# EAGLE design ZeroESPminimal (EAGLE 6.5.0)
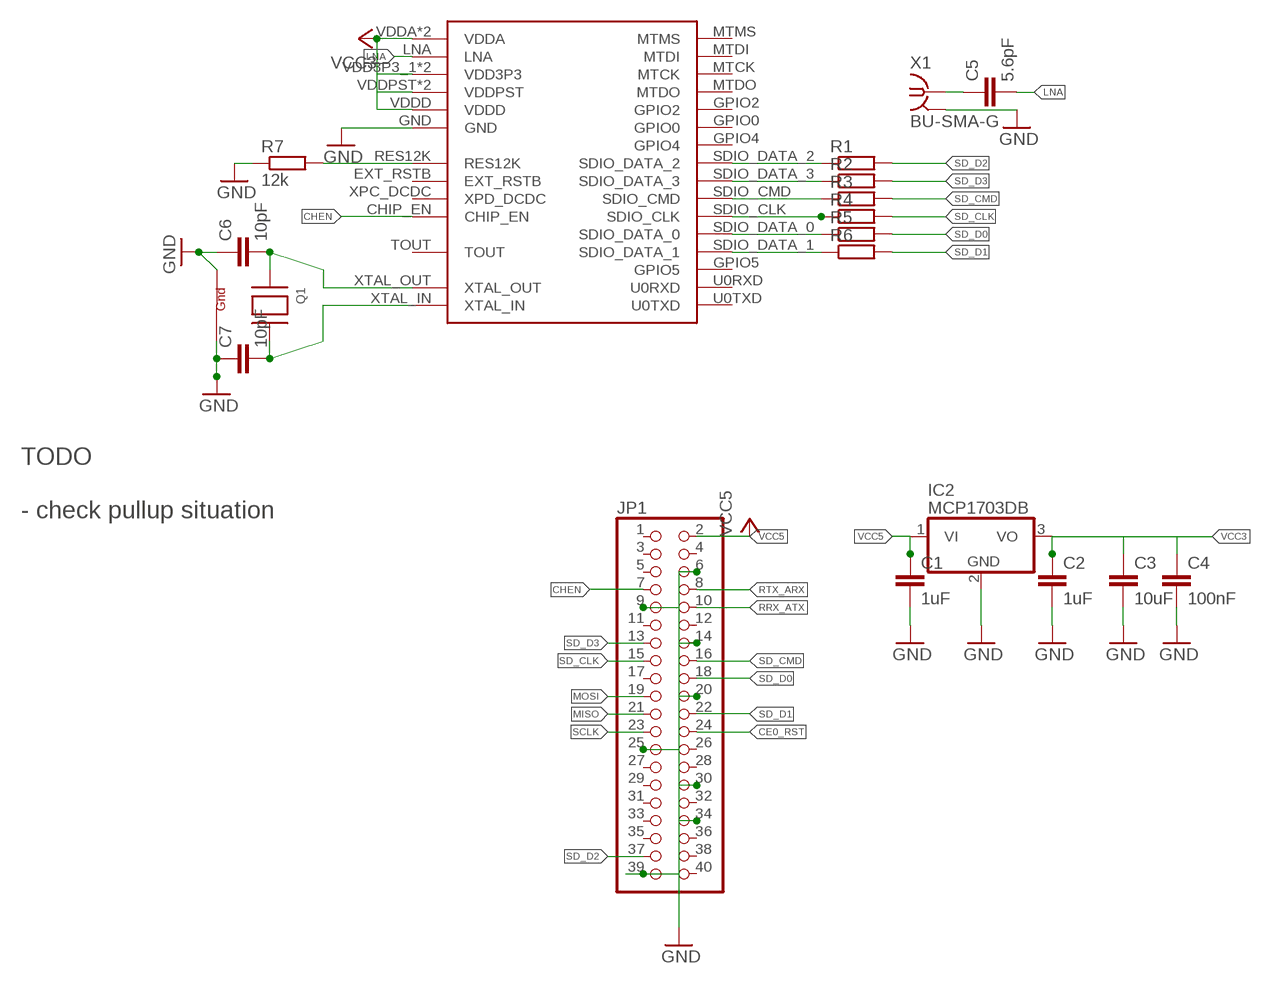
[diagram p0: schematic, sheet 1]

## Parts
C1  1uF  C-EUC1206  [C1206]
C2  1uF  C-EUC1206  [C1206]
C3  10uF  C-EUC1206  [C1206]
C4  100nF  C-EUC1206  [C1206]
C5  5.6pF  C-EUC0402  [C0402]
C6  10pF  C-EUC0402  [C0402]
C7  10pF  C-EUC0402  [C0402]
IC2  MCP1703DB  [SOT223]
JP1  PINHD-2X20  [2X20]
Q1  XTAL-4-3225  [NX3225]
R1  R-EU_R0402  [R0402]
R2  R-EU_R0402  [R0402]
R3  R-EU_R0402  [R0402]
R4  R-EU_R0402  [R0402]
R5  R-EU_R0402  [R0402]
R6  R-EU_R0402  [R0402]
R7  12k  R-EU_R0402  [R0402]
U$3  ESP8266EX  [ESP8266EX]
X1  BU-SMA-G  [BU-SMA-G]

## Nets
$N22: R3.1 U$3.SDIO_CMD
$N23: R5.1 U$3.SDIO_DATA_0
$N24: R6.1 U$3.SDIO_DATA_1
CE0_RST: JP1.24
CHEN: JP1.7 U$3.CHIP_EN
GND: C1.2 C2.2 C3.2 C4.2 C6.1 C7.1 IC2.2(GND) JP1.6 JP1.9 JP1.14 JP1.20 JP1.25 JP1.30 JP1.34 JP1.39 Q1.2(G2) Q1.4(G1) R7.1 U$3.GND X1.2 X1.3 X1.4 X1.5
LNA: C5.2 U$3.LNA
MISO: JP1.21
MOSI: JP1.19
N$1: R1.1 U$3.SDIO_DATA_2
N$2: R2.1 U$3.SDIO_DATA_3
N$3: C5.1 X1.1
N$4: R4.1 U$3.SDIO_CLK
N$5: R7.2 U$3.RES12K
N$7: C6.2 Q1.1(X1) U$3.XTAL_OUT
N$9: C7.2 Q1.3(X2) U$3.XTAL_IN
RRX_ATX: JP1.10
RTX_ARX: JP1.8
SCLK: JP1.23
SD_CLK: JP1.15 R4.2
SD_CMD: JP1.16 R3.2
SD_D0: JP1.18 R5.2
SD_D1: JP1.22 R6.2
SD_D2: JP1.37 R1.2
SD_D3: JP1.13 R2.2
VCC3: C2.1 C3.1 C4.1 IC2.3(VO) U$3.VDD3P3_1(VDD3P3) U$3.VDD3P3_2(VDD3P3) U$3.VDDA U$3.VDDA_2(VDDA) U$3.VDDD U$3.VDDPST U$3.VDDPST_2(VDDPST)
VCC5: C1.1 IC2.1(VI) JP1.2
Unconnected: JP1.1 JP1.3 JP1.4 JP1.5 JP1.11 JP1.12 JP1.17 JP1.26 JP1.27 JP1.28 JP1.29 JP1.31 JP1.32 JP1.33 JP1.35 JP1.36 JP1.38 JP1.40 U$3.EXT_RSTB U$3.GPIO0 U$3.GPIO2 U$3.GPIO4 U$3.GPIO5 U$3.MTCK U$3.MTDI U$3.MTDO U$3.MTMS U$3.TOUT U$3.U0RXD U$3.U0TXD U$3.XPC_DCDC(XPD_DCDC)

## Notes on the sheet
- TODO
  
  - check pullup situation

## Library data of the parts
C1-C4 = rcl:C-EU: CAPACITOR, European symbol
C5-C7 = resistor:C-EU: CAPACITOR, European symbol
IC2 = linear:MCP1703: 250 mA, 16V, Low Quiescent Current LDO Regulator Source: http://ww1.microchip.com/downloads/en/DeviceDoc/22049b.pdf
JP1 = adafruit:PINHD-2X20: PIN HEADER
Q1 = adafruit:XTAL-4: Classic 4-pin 3.2 x 2.5mm crystal
R1-R6 = rcl:R-EU_: RESISTOR, European symbol
R7 = resistor:R-EU_: RESISTOR, European symbol
U$3 = ESP8266EX:ESP8266EX
X1 = con-coax:BU-SMA-G: FEMALE SMA CONNECTOR Radiall distributor RS 193-9117; OC_FARNELL: unknown; OC_NEWARK: unknown

## Board
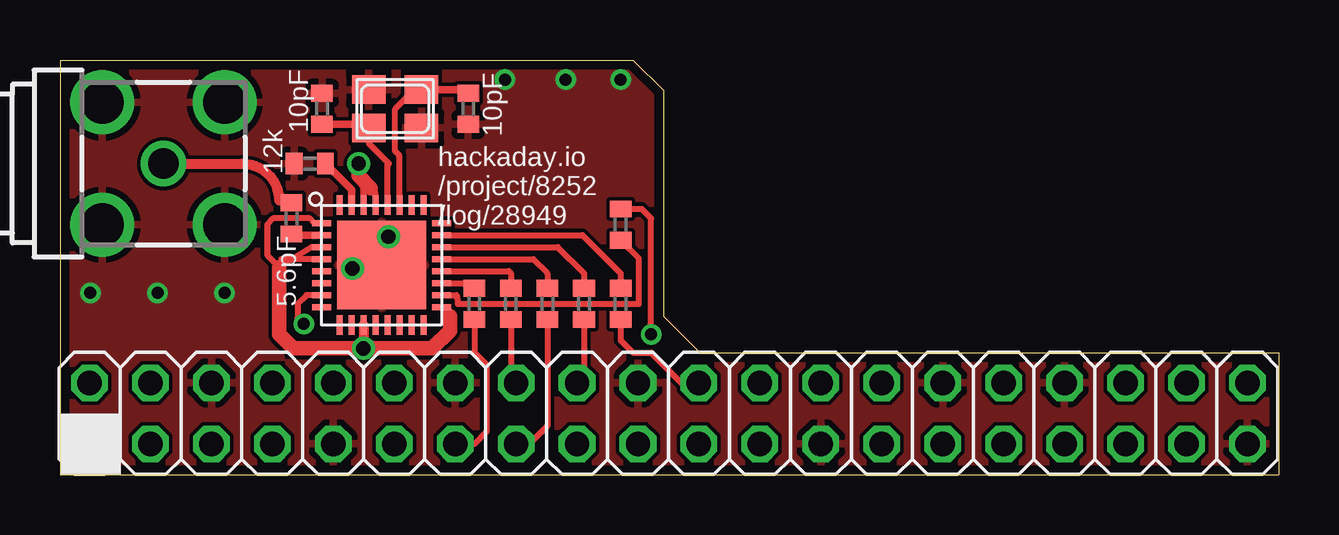
[diagram p1: board, top side]
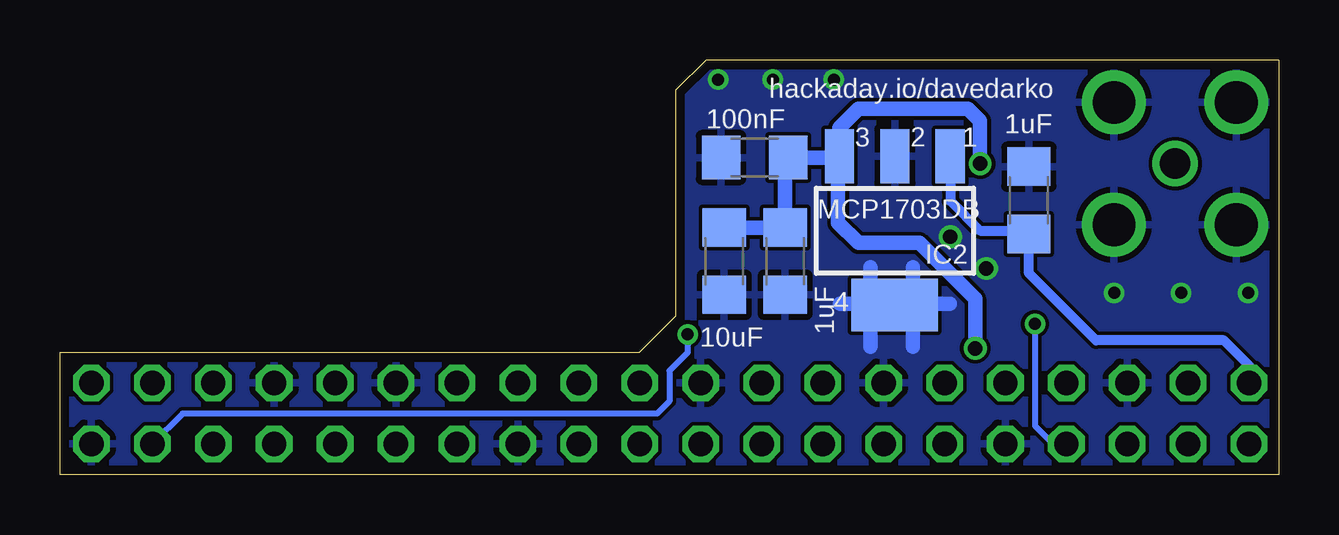
[diagram p2: board, bottom side, seen from below]

Size 50.8 x 17.27 mm. Coordinates in mm from the lower left corner, seen from the top.
Outline: 0,0 50.8,0 50.8,5.08 26.67,5.08 25.15,6.6 25.15,16 23.88,17.27 0,17.27 0,0
Copper layers (1*16): Top 0.0356mm / dielectric 1.5011mm / Bottom 0.0356mm
Design rules "LaenPCBOrder *": minimum track width 6mil, minimum drill 13mil, track to track 6mil, track to pad 6mil, pad to pad 6mil, via to via 6mil, smd to smd 6mil, copper to edge 15mil, drill to drill 6mil, minimum pad ring 7mil, minimum via ring 7mil, stop-mask expansion 3mil, vias tented up to drill 200mil, thermal gap 10mil

### Footprints (pad centres in the part's own frame; a part is rotated, then mirrored left to right if it is on the bottom)
C1206 = smd 1.6 x 1.8: 1 -1.4,0; 2 1.4,0
C0402 = smd 0.7 x 0.9: 1 -0.65,0; 2 0.65,0
SOT223 = smd 1.219 x 2.235: 1 -2.311,-3.099; 2 0,-3.099; 3 2.311,-3.099 | smd 3.6 x 2.2: 4 0,3.099
2X20 = drill 1.016 octagon: 1 -24.13,-1.27; 2 -24.13,1.27; 3 -21.59,-1.27; 4 -21.59,1.27; 5 -19.05,-1.27; 6 -19.05,1.27; 7 -16.51,-1.27; 8 -16.51,1.27; 9 -13.97,-1.27; 10 -13.97,1.27; 11 -11.43,-1.27; 12 -11.43,1.27; 13 -8.89,-1.27; 14 -8.89,1.27; 15 -6.35,-1.27; 16 -6.35,1.27; 17 -3.81,-1.27; 18 -3.81,1.27; 19 -1.27,-1.27; 20 -1.27,1.27; 21 1.27,-1.27; 22 1.27,1.27; 23 3.81,-1.27; 24 3.81,1.27; 25 6.35,-1.27; 26 6.35,1.27; 27 8.89,-1.27; 28 8.89,1.27; 29 11.43,-1.27; 30 11.43,1.27; 31 13.97,-1.27; 32 13.97,1.27; 33 16.51,-1.27; 34 16.51,1.27; 35 19.05,-1.27; 36 19.05,1.27; 37 21.59,-1.27; 38 21.59,1.27; 39 24.13,-1.27; 40 24.13,1.27
NX3225 = smd 1.4 x 1.2: 1 -1.1,-0.8; 2 1.1,-0.8; 3 1.1,0.8; 4 -1.1,0.8
R0402 = smd 0.7 x 0.9: 1 -0.65,0; 2 0.65,0
ESP8266EX = smd 0.8 x 0.25: CHIP_EN -2.5,-1.25; GPIO5 2.5,1.75; LNA -2.5,1.25; SDIO_CLK 2.5,0.25; SDIO_CMD 2.5,-0.25; SDIO_DATA_0 2.5,0.75; SDIO_DATA_1 2.5,1.25; SDIO_DATA_2 2.5,-1.25; SDIO_DATA_3 2.5,-0.75; TOUT -2.5,-0.75; VDD3P3_1 -2.5,0.75; VDD3P3_2 -2.5,0.25; VDD_RTC -2.5,-0.25; VDDA -2.5,1.75; VDDPST_2 2.5,-1.75; XPC_DCDC -2.5,-1.75 | smd 0.25 x 0.8: EXT_RSTB -1.75,2.5; GPIO0 1.25,-2.5; GPIO2 0.75,-2.5; GPIO4 1.75,-2.5; MTCK -0.25,-2.5; MTDI -1.25,-2.5; MTDO 0.25,-2.5; MTMS -1.75,-2.5; RES12K -1.25,2.5; U0RXD 1.75,2.5; U0TXD 1.25,2.5; VDDA_2 -0.75,2.5; VDDD -0.25,2.5; VDDPST -0.75,-2.5; XTAL_IN 0.25,2.5; XTAL_OUT 0.75,2.5 | smd 3.7 x 3.7: GND 0,0
BU-SMA-G = drill 1.27: 1 0,0 | drill 1.778: 2 -2.55,2.55; 3 2.55,2.55; 4 2.55,-2.55; 5 -2.55,-2.55

### Placement (x,y rotation side)
C1  10.41,11.43 90 bottom
C2  20.57,8.89 270 bottom
C3  23.11,8.89 270 bottom
C4  21.84,13.21 180 bottom
C5  9.65,10.67 270 top
C6  17.02,15.24 90 top
C7  10.92,15.24 270 top
IC2  16,10.16 180 bottom
JP1  25.36,2.55 0 top
Q1  13.97,15.24 180 top
R1  23.37,10.41 90 top
R2  17.27,7.11 270 top
R3  18.8,7.11 270 top
R4  20.32,7.11 270 top
R5  21.84,7.11 270 top
R6  23.37,7.11 270 top
R7  10.41,12.95 0 top
U$3  13.4,8.73 0 top
X1  4.32,12.95 180 top

### Tracks (layer width: path | path; a pad name or v marks a point on that pad's centre or on a via)
$N22
  Top 0.254: U$3.SDIO_CMD 18.7,8.48 18.8,8.38 R3.1
$N23
  Top 0.254: U$3.SDIO_DATA_0 20.75,9.48 21.84,8.38 R5.1
$N24
  Top 0.254: U$3.SDIO_DATA_1 21.77,9.98 23.37,8.38 R6.1
CHEN  (via drill 0.5)
  Top 0.254: U$3.CHIP_EN 10.27,7.48 9.91,7.11 9.91,6.53 v10.16,6.27
  Bottom 0.254: v10.16,6.27 10.16,2.03 9.4,1.27 JP1.7
GND  (via drill 0.5, 0.6)
  Bottom 0.61: 17.02,8.64 17.02,7.87 | 17.53,7.11 18.29,7.11 | 15.24,6.35 15.24,5.33 | 13.72,7.11 14.48,7.11 | 17.02,6.35 17.02,5.33 | 15.24,8.64 15.24,7.87
  other vias: 13.69,9.91 12.19,8.59 1.27,7.57 18.54,16.46 21.08,16.46 23.37,16.46 4.06,7.57 6.86,7.57
  pour Bottom: -0.07,17.19 23.96,17.19 25.15,16 25.15,6.6 26.67,5.08 50.84,5.05 50.84,-0.03 -0.07,-0.09
  pour Top: -0.08,17.19 -0.08,-0.09 50.87,-0.09 50.87,3.98 50.8,5.08 26.67,5.08 25.15,6.6 25.15,16 23.88,17.27
LNA
  Top 0.305: U$3.LNA 9.69,9.98 C5.2
N$1
  Top 0.254: U$3.SDIO_DATA_2 16.52,7.48 16.59,7.11 24.13,7.11 24.13,9 R1.1
N$2
  Top 0.254: U$3.SDIO_DATA_3 17.06,7.98 R2.1
N$3
  Top 0.305: 9.54,11.43 9.14,11.41 C5.1
  Top 0.406: X1.1 7.6,12.95 arc-90 9.14,11.41
N$4
  Top 0.254: U$3.SDIO_CLK 19.72,8.98 20.32,8.38 R4.1
N$5
  Top 0.305: U$3.RES12K 12.15,11.87 R7.2
N$7
  Top 0.254: Q1.1 14.77,16.04 13.97,15.24 13.97,13.46 14.15,13.28 U$3.XTAL_OUT
  Top 0.305: Q1.1 16.87,16.04 C6.2
N$9
  Top 0.254: Q1.3 12.87,13.8 13.72,12.95 13.65,12.89 U$3.XTAL_IN
  Top 0.305: C7.2 12.72,14.59 Q1.3
SD_CLK
  Top 0.254: R4.2 20.32,2.03 19.56,1.27 JP1.15
SD_CMD
  Top 0.254: R3.2 18.8,4.03 JP1.16
SD_D0
  Top 0.254: R5.2 21.84,4.11 JP1.18
SD_D1
  Top 0.254: R6.2 23.37,5.59 23.88,5.08 24.64,5.08 25.91,3.81 26.67,3.78 JP1.22
SD_D2  (via drill 0.5)
  Top 0.254: R1.2 24.24,11.06 24.64,10.67 v24.64,5.84
  Bottom 0.254: v24.64,5.84 24.64,5.08 25.4,4.32 25.4,3.05 25.91,2.54 45.69,2.54 JP1.37
SD_D3
  Top 0.254: R2.2 17.27,5.08 17.78,4.57 17.78,1.78 17.27,1.27 JP1.13
VCC3  (via drill 0.6)
  Top 0.254: U$3.VDDA_2 12.65,11.89 12.95,11.94 13.15,11.74 U$3.VDDD | 9.14,8.64 9.23,8.98 U$3.VDD3P3_2 | U$3.VDDA 10.6,10.48 10.41,10.67 8.89,10.67 8.64,10.41 8.64,9.14 9.14,8.64 | U$3.VDDPST_2 15.9,6.96 16.26,6.6 | U$3.VDD3P3_1 10.49,9.48 9.14,8.64
  Top 0.406: v12.65,5.26 12.65,5.64 | U$3.VDDPST 12.65,5.64 | 12.6,5.26 12.65,5.64
  Top 0.61: 9.14,8.64 9.14,5.84 9.73,5.26 12.6,5.26 | v12.45,12.95 12.45,12.45 12.95,11.94 | 16.26,6.6 16.26,5.99 15.52,5.26 v12.65,5.26
  Bottom 0.406: 20.57,13.08 C4.1
  Bottom 0.61: C3.1 C2.1 20.57,13.08 | v12.45,12.95 12.45,14.73 12.95,15.24 17.53,15.24 18.31,14.45 IC2.3 18.36,13.21 | 18.36,13.21 18.36,10.49 17.53,9.65 14.99,9.65 12.65,7.32 v12.65,5.26 | C4.1 18.36,13.21
VCC5
  Bottom 0.406: IC2.1 13.69,11.4 12.45,10.16 11.05,10.16 C1.1 10.41,8.38 7.62,5.59 2.29,5.59 1.23,4.54 JP1.2

### Text on the board
tNames: hackaday.io / /project/8252 / /log/28949
bNames: hackaday.io/davedarko